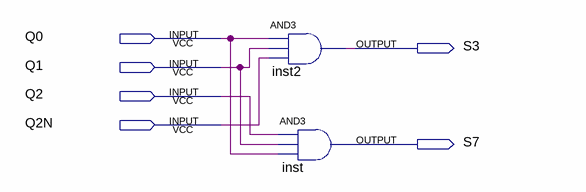
[diagram p0: schematic sheet]
// Quartus schematic CC.bdf as structural Verilog: 2 symbols, 6 pins
module CC (
  input  Q0,
  input  Q1,
  input  Q2,
  input  Q2N,
  output S3,
  output S7
);

  and inst2 (S3, Q0, Q1, Q2N);
  and inst (S7, Q2, Q1, Q0);
endmodule
